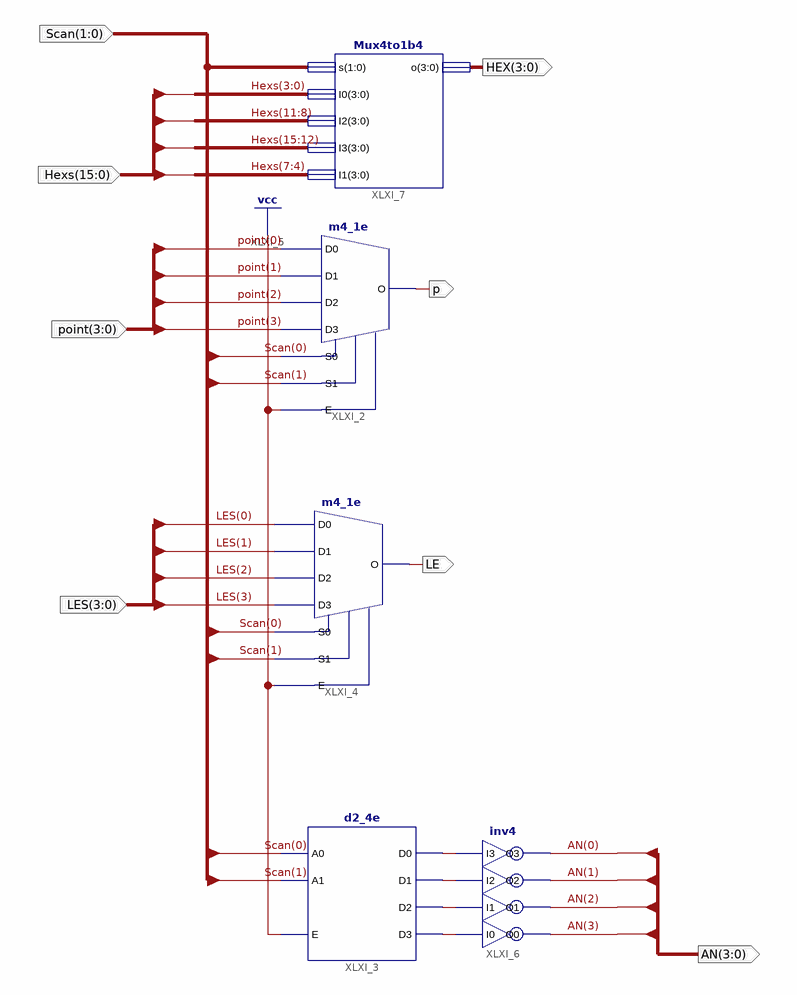
[diagram p0: schematic sheet 1]
// Xilinx ISE schematic DisplaySync.sch (kintex7) as structural Verilog: 5 symbols, 8 ports
module DisplaySync (
  input  [15:0] Hexs,
  input  [3:0] point,
  input  [3:0] LES,
  input  [1:0] Scan,
  output [3:0] HEX,
  output [3:0] AN,
  output p,
  output LE
);

  wire XLXN_27, XLXN_28, XLXN_29, XLXN_30;

  m4_1e XLXI_2 (
    .D0(point[0]), .D1(point[1]), .D2(point[2]), .D3(point[3]), .E(1'b1), .S0(Scan[0]), .S1(Scan[1]), .O(p));
  d2_4e XLXI_3 (.A0(Scan[0]), .A1(Scan[1]), .E(1'b1), .D0(XLXN_30), .D1(XLXN_29), .D2(XLXN_28), .D3(XLXN_27));
  m4_1e XLXI_4 (.D0(LES[0]), .D1(LES[1]), .D2(LES[2]), .D3(LES[3]), .E(1'b1), .S0(Scan[0]), .S1(Scan[1]), .O(LE));
  inv4 XLXI_6 (.I0(XLXN_27), .I1(XLXN_28), .I2(XLXN_29), .I3(XLXN_30), .O0(AN[3]), .O1(AN[2]), .O2(AN[1]), .O3(AN[0]));
  Mux4to1b4 XLXI_7 (.s(Scan), .I0(Hexs[3:0]), .I2(Hexs[11:8]), .I3(Hexs[15:12]), .I1(Hexs[7:4]), .o(HEX));
endmodule
